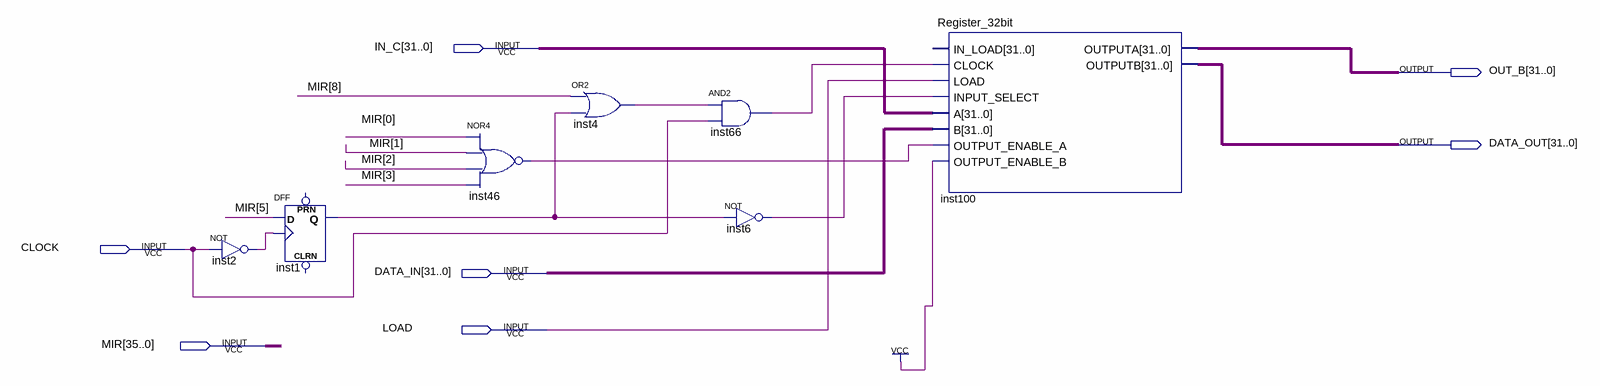
[diagram p0: schematic sheet]
// Quartus schematic MDR.bdf as structural Verilog: 7 symbols, 7 pins
module MDR (
  input  [31:0] IN_C,
  input  CLOCK,
  input  [31:0] DATA_IN,
  input  LOAD,
  input  [35:0] MIR,
  output [31:0] OUT_B,
  output [31:0] DATA_OUT
);

  wire inst1_q, inst2_out, inst4_out, inst6_out, inst46_out, inst66_out;

  not inst2 (inst2_out, CLOCK);
  DFF inst1 (.CLK(inst2_out), .D(MIR[5]), .Q(inst1_q));  // open: CLRN, PRN
  nor inst46 (inst46_out, MIR[0], MIR[1], MIR[2], MIR[3]);
  or inst4 (inst4_out, MIR[8], inst1_q);
  and inst66 (inst66_out, inst4_out, CLOCK);
  not inst6 (inst6_out, inst1_q);
  Register_32bit inst100 (
    .CLOCK(inst66_out), .LOAD(LOAD), .INPUT_SELECT(inst6_out), .A(IN_C), .B(DATA_IN),
    .OUTPUT_ENABLE_A(inst46_out), .OUTPUT_ENABLE_B(1'b1), .OUTPUTA(OUT_B), .OUTPUTB(DATA_OUT));  // open: IN_LOAD
endmodule
